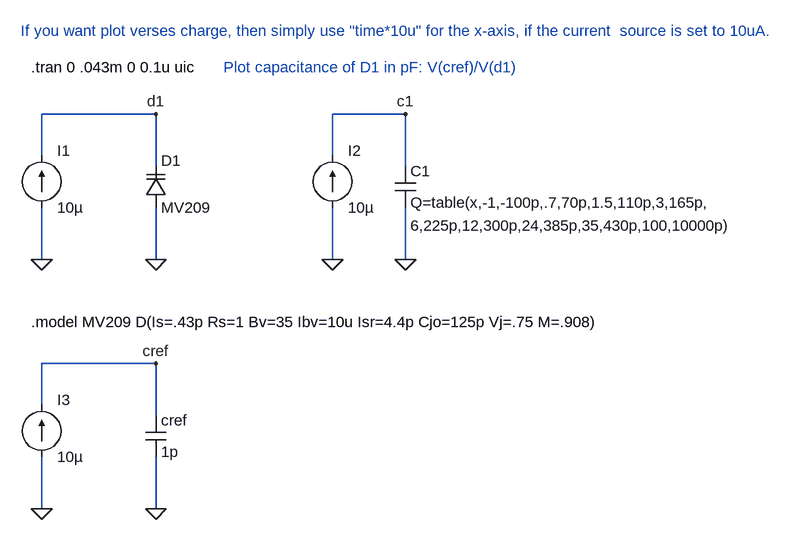
[diagram p0: schematic Mv209.asc]
Mv209.asc, the LTspice schematic file:
Version 4
SHEET 1 1412 820
WIRE -464 416 -464 336
WIRE -464 256 -464 192
WIRE -464 192 -288 192
WIRE -288 192 -288 272
WIRE -288 336 -288 416
WIRE -16 416 -16 336
WIRE -16 256 -16 192
WIRE -16 192 96 192
WIRE 96 192 96 272
WIRE 96 336 96 416
WIRE -464 800 -464 720
WIRE -464 640 -464 576
WIRE -464 576 -288 576
WIRE -288 576 -288 656
WIRE -288 720 -288 800
FLAG -464 416 0
FLAG -288 416 0
FLAG -16 416 0
FLAG 96 416 0
FLAG -464 800 0
FLAG -288 800 0
FLAG -288 192 d1
FLAG 96 192 c1
FLAG -288 576 cref
SYMBOL varactor -304 336 M180
WINDOW 0 24 72 Left 0
WINDOW 3 24 0 Left 0
SYMATTR InstName D1
SYMATTR Value MV209
SYMBOL current -464 336 M180
WINDOW 0 24 88 Left 0
WINDOW 3 24 0 Left 0
SYMATTR InstName I1
SYMATTR Value 10µ
SYMBOL current -16 336 M180
WINDOW 0 24 88 Left 0
WINDOW 3 24 0 Left 0
SYMATTR InstName I2
SYMATTR Value 10µ
SYMBOL cap 80 272 R0
WINDOW 123 24 92 Left 0
SYMATTR Value2 6,225p,12,300p,24,385p,35,430p,100,10000p)
SYMATTR InstName C1
SYMATTR Value Q=table(x,-1,-100p,.7,70p,1.5,110p,3,165p,
SYMBOL current -464 720 M180
WINDOW 0 24 88 Left 0
WINDOW 3 24 0 Left 0
SYMATTR InstName I3
SYMATTR Value 10µ
SYMBOL cap -304 656 R0
SYMATTR InstName cref
SYMATTR Value 1p
TEXT -480 512 Left 0 !.model MV209 D(Is=.43p Rs=1 Bv=35 Ibv=10u Isr=4.4p Cjo=125p Vj=.75 M=.908)
TEXT -480 120 Left 0 !.tran 0 .043m 0 0.1u uic
TEXT -184 120 Left 0 ;Plot capacitance of D1 in pF: V(cref)/V(d1)
TEXT -496 64 Left 0 ;If you want plot verses charge, then simply use "time*10u" for the x-axis, if the current  source is set to 10uA.

The netlist it stands for:
* Mv209.asc
D1 0 d1 MV209
I1 0 d1 10µ
I2 0 c1 10µ
C1 c1 0 Q=table(x,-1,-100p,.7,70p,1.5,110p,3,165p, 6,225p,12,300p,24,385p,35,430p,100,10000p)
I3 0 cref 10µ
cref cref 0 1p
.model D D
.lib standard.dio
.model MV209 D(Is=.43p Rs=1 Bv=35 Ibv=10u Isr=4.4p Cjo=125p Vj=.75 M=.908)
.tran 0 .043m 0 0.1u uic
* Plot capacitance of D1 in pF: V(cref)/V(d1)
* If you want plot verses charge, then simply use "time*10u" for the x-axis, if the current  source is set to 10uA.
.backanno
.end